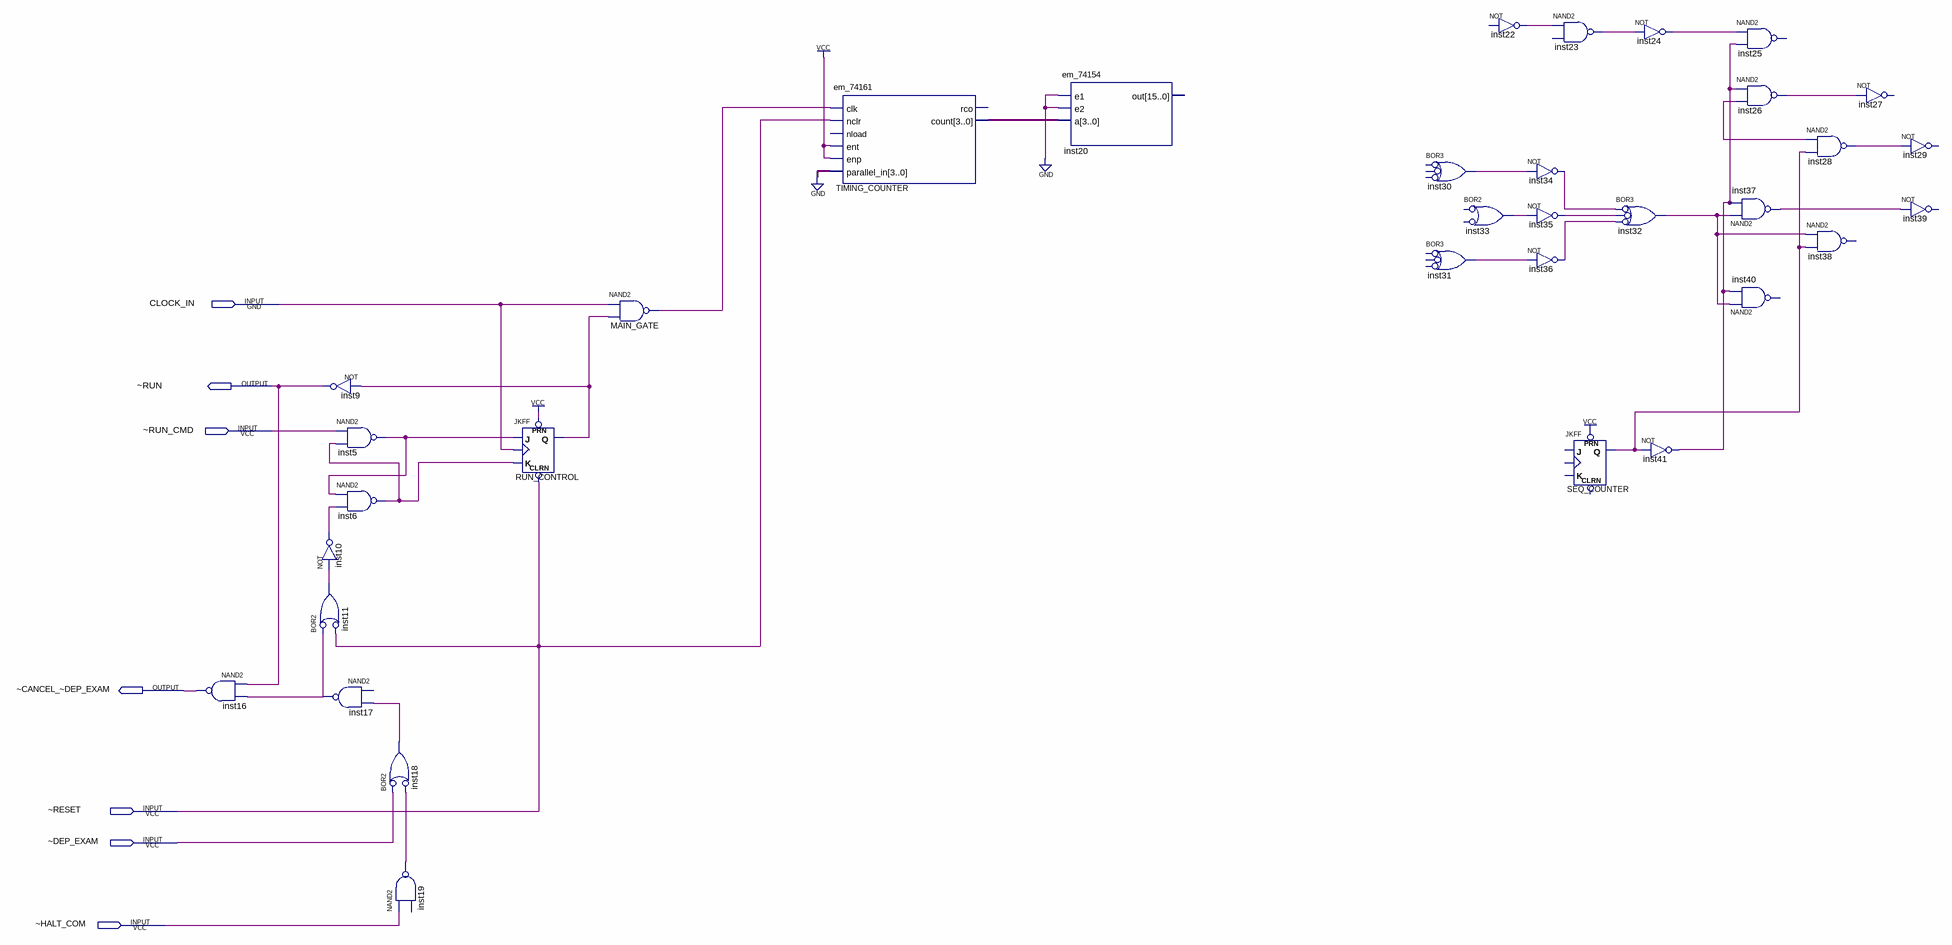
[diagram p0: schematic sheet]
// Quartus schematic E8T.bdf as structural Verilog: 34 symbols, 7 pins
module E8T (
  input  CLOCK_IN,
  input  \~RUN_CMD ,
  input  \~RESET ,
  input  \~DEP_EXAM ,
  input  \~HALT_COM ,
  output \~RUN ,
  output \~CANCEL_~DEP_EXAM 
);

  wire inst5_out, inst6_out, inst10_out, inst11_out, inst17_out, inst18_out, inst19_out, inst22_out,
       inst23_out, inst24_out, inst26_out, inst28_out, inst30_out, inst31_out, inst32_out, inst33_out,
       inst34_out, inst35_out, inst36_out, inst37_out, inst41_out, MAIN_GATE_out, RUN_CONTROL_q,
       SEQ_COUNTER_q, undriven;
  wire [3:0] TIMING_COUNTER_count;

  nand inst16 (\~CANCEL_~DEP_EXAM , \~RUN , inst17_out);
  not inst9 (\~RUN , RUN_CONTROL_q);
  nand inst5 (inst5_out, \~RUN_CMD , inst6_out);
  nand inst6 (inst6_out, inst5_out, inst10_out);
  not inst10 (inst10_out, inst11_out);
  or inst11 (inst11_out, ~inst17_out, ~\~RESET );  // BOR2
  not inst17 (inst17_out, inst18_out);  // NAND2 open: IN1
  or inst18 (inst18_out, ~\~DEP_EXAM , ~inst19_out);  // BOR2
  not inst19 (inst19_out, \~HALT_COM );  // NAND2 open: IN2
  JKFF RUN_CONTROL (.PRN(1'b1), .CLRN(\~RESET ), .K(inst6_out), .J(inst5_out), .CLK(CLOCK_IN), .Q(RUN_CONTROL_q));
  nand MAIN_GATE (MAIN_GATE_out, CLOCK_IN, RUN_CONTROL_q);
  em_74161 TIMING_COUNTER (
    .clk(MAIN_GATE_out), .enp(1'b1), .ent(1'b1), .nclr(\~RESET ), .parallel_in(4'b0000),
    .count(TIMING_COUNTER_count));  // open: nload, rco
  em_74154 inst20 (.e1(1'b0), .e2(1'b0), .a(TIMING_COUNTER_count));  // open: out
  // BOR3 inst30 has open pins: IN1=open, IN2=open, IN3=open, OUT=inst30_out
  // BOR3 inst31 has open pins: IN1=open, IN2=open, IN3=open, OUT=inst31_out
  // NOT inst22 has open pins: IN=open, OUT=inst22_out
  // BOR2 inst33 has open pins: IN1=open, IN2=open, OUT=inst33_out
  not inst23 (inst23_out, inst22_out);  // NAND2 open: IN2
  not inst34 (inst34_out, inst30_out);
  not inst35 (inst35_out, inst33_out);
  not inst36 (inst36_out, inst31_out);
  JKFF SEQ_COUNTER (.PRN(1'b1), .Q(SEQ_COUNTER_q));  // open: CLRN, K, J, CLK
  not inst24 (inst24_out, inst23_out);
  or inst32 (inst32_out, ~inst34_out, ~inst35_out, ~inst36_out);  // BOR3
  not inst41 (inst41_out, SEQ_COUNTER_q);
  // NAND2 inst25 has open pins: IN1=inst24_out, IN2=inst41_out, OUT=open
  nand inst26 (inst26_out, inst41_out, undriven);
  nand inst37 (inst37_out, inst32_out, inst41_out);
  // NAND2 inst40 has open pins: IN1=inst32_out, IN2=inst41_out, OUT=open
  nand inst28 (inst28_out, undriven, SEQ_COUNTER_q);
  // NAND2 inst38 has open pins: IN1=inst32_out, IN2=SEQ_COUNTER_q, OUT=open
  // NOT inst27 has open pins: IN=inst26_out, OUT=open
  // NOT inst29 has open pins: IN=inst28_out, OUT=open
  // NOT inst39 has open pins: IN=inst37_out, OUT=open
endmodule
